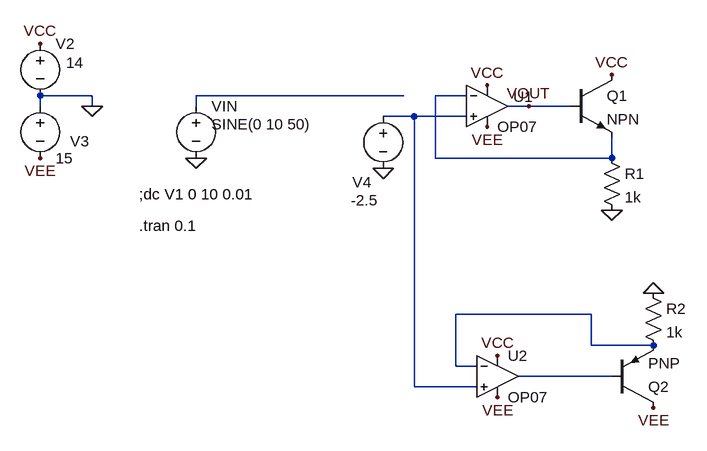
[diagram p0: schematic Draft4.asc]
Draft4.asc, the LTspice schematic file:
Version 4
SHEET 1 880 680
WIRE -192 80 -272 80
WIRE 288 80 -32 80
WIRE 384 80 336 80
WIRE -272 96 -272 80
WIRE -192 96 -192 80
WIRE -32 96 -32 80
WIRE 480 96 448 96
WIRE 544 96 480 96
WIRE 304 112 256 112
WIRE 384 112 304 112
WIRE 336 176 336 80
WIRE 608 176 608 144
WIRE 608 176 336 176
WIRE 576 416 368 416
WIRE 576 464 576 416
WIRE 672 464 576 464
WIRE 368 496 368 416
WIRE 400 496 368 496
WIRE 608 512 464 512
WIRE 304 528 304 112
WIRE 400 528 304 528
FLAG -32 176 0
FLAG -192 96 0
FLAG 480 96 VOUT
FLAG 256 192 0
FLAG -272 0 VCC
FLAG -272 176 VEE
FLAG 416 128 VEE
FLAG 608 48 VCC
FLAG 416 64 VCC
FLAG 608 256 0
FLAG 432 480 VCC
FLAG 432 544 VEE
FLAG 672 560 VEE
FLAG 672 384 0
SYMBOL voltage -32 80 R0
WINDOW 123 0 0 Left 0
WINDOW 39 0 0 Left 0
WINDOW 3 24 44 Left 2
SYMATTR Value SINE(0 10 50)
SYMATTR InstName VIN
SYMBOL OpAmps\\OP07 416 32 R0
WINDOW 0 40 50 Left 2
SYMATTR InstName U1
SYMBOL voltage -272 -16 R0
WINDOW 123 0 0 Left 0
WINDOW 39 0 0 Left 0
WINDOW 3 40 45 Left 2
SYMATTR Value 14
SYMATTR InstName V2
SYMBOL voltage -272 80 R0
WINDOW 123 0 0 Left 0
WINDOW 39 0 0 Left 0
WINDOW 0 46 70 Left 2
SYMATTR InstName V3
SYMATTR Value 15
SYMBOL voltage 256 96 R0
WINDOW 0 -47 117 Left 2
WINDOW 3 -50 145 Left 2
WINDOW 123 0 0 Left 0
WINDOW 39 0 0 Left 0
SYMATTR InstName V4
SYMATTR Value -2.5
SYMBOL npn 544 48 R0
SYMATTR InstName Q1
SYMBOL res 592 160 R0
SYMATTR InstName R1
SYMATTR Value 1k
SYMBOL OpAmps\\OP07 432 448 R0
SYMATTR InstName U2
SYMBOL pnp 608 560 M180
SYMATTR InstName Q2
SYMBOL res 656 368 R0
SYMATTR InstName R2
SYMATTR Value 1k
TEXT -120 232 Left 2 !;dc V1 0 10 0.01
TEXT -120 280 Left 2 !.tran 0.1

The netlist it stands for:
* Draft4.asc
VIN N001 0 SINE(0 10 50)
XU1 N003 N002 VCC VEE VOUT LT1001  ; OP07, pins In+ In- V+ V- OUT
V2 VCC 0 14
V3 0 VEE 15
V4 N003 0 -2.5
Q1 VCC VOUT N002 0 NPN
R1 N002 0 1k
XU2 N003 N004 VCC VEE N005 LT1001  ; OP07, pins In+ In- V+ V- OUT
Q2 VEE N005 N004 0 PNP
R2 0 N004 1k
.model NPN NPN
.model PNP PNP
.lib standard.bjt
;dc V1 0 10 0.01
.tran 0.1
.lib LTC.lib
.backanno
.end